# Altium project Geiger counter schema.PrjPcb
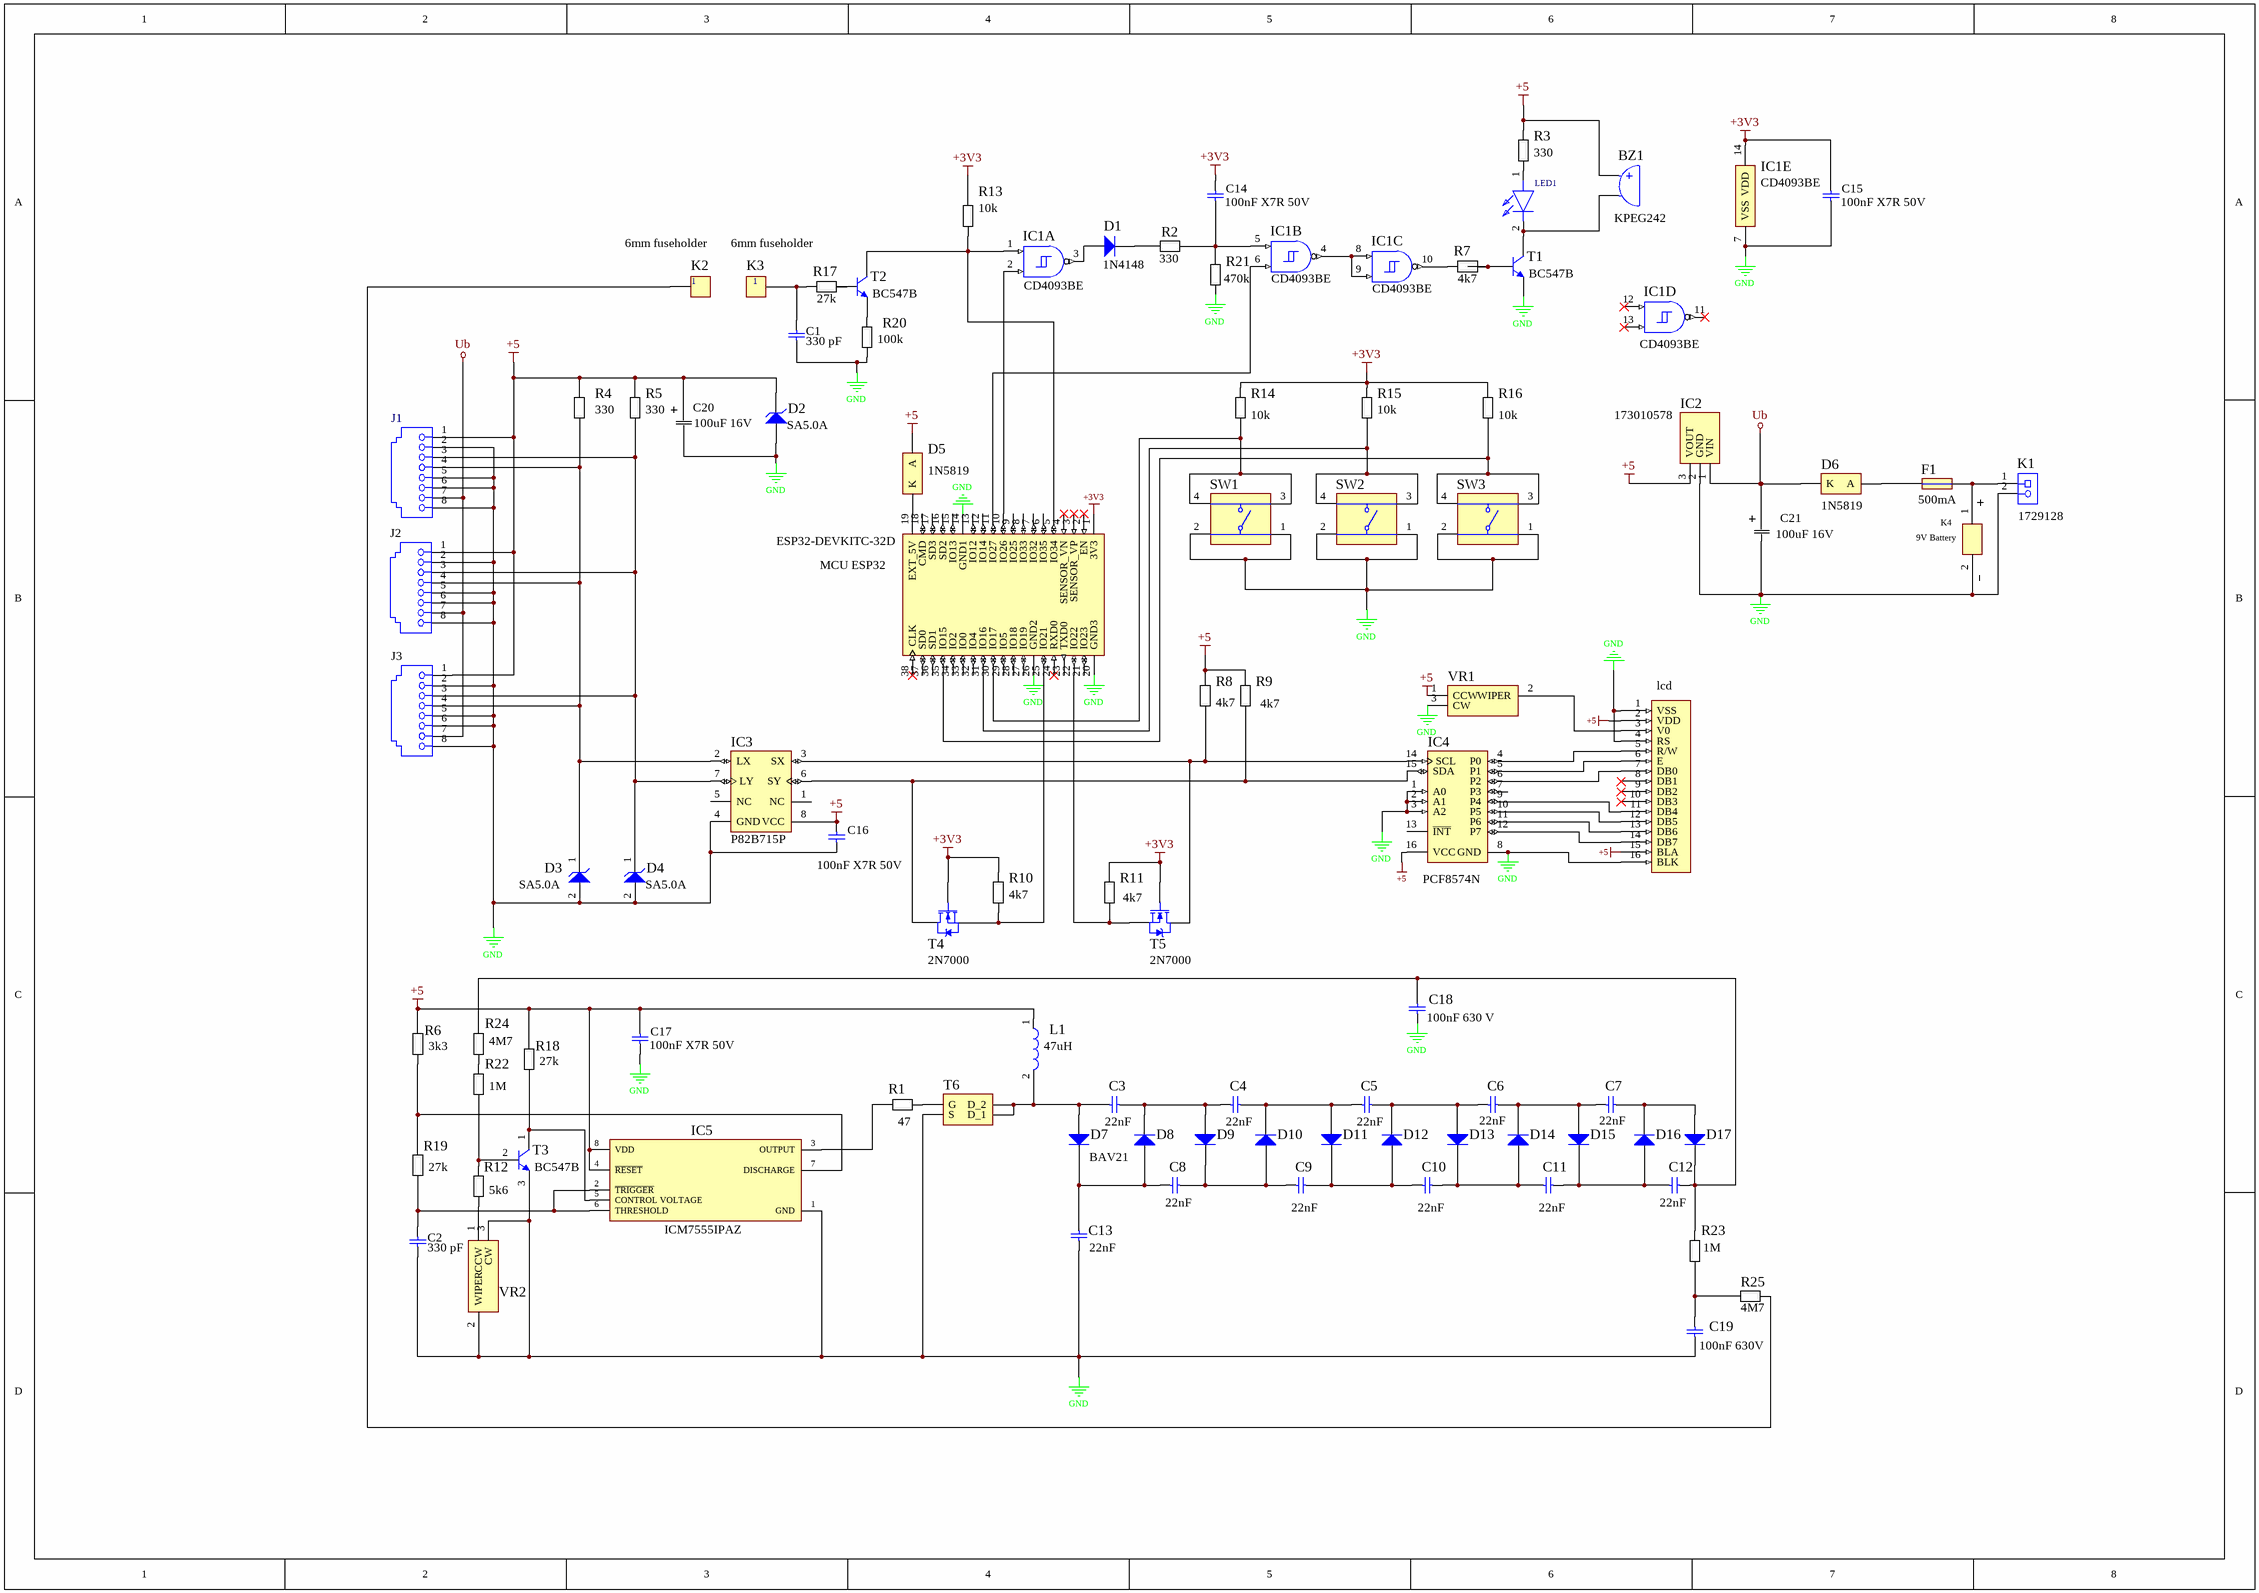
[diagram p0: Sheet1.SchDoc]
1 sheet, 92 parts. Net scope: global (net labels, ports and power ports of the same name join across sheets).
Board file: PCB1.PcbDoc

## Sheet Sheet1.SchDoc
size A2; SheetNumber: 1; SheetTotal: 1

### Parts
BZ1  KPEG242  [KINGS-KPEG242-2]
C1  330 pF  [CAPC2013X70X45NL10T25]
C2  330 pF  [CAPC2013X70X45NL10T25]
C3  22nF  [VISH-BFC233820104-2_V]
C4  22nF  [VISH-BFC233820104-2_V]
C5  22nF  [VISH-BFC233820104-2_V]
C6  22nF  [VISH-BFC233820104-2_V]
C7  22nF  [VISH-BFC233820104-2_V]
C8  22nF  [VISH-BFC233820104-2_V]
C9  22nF  [VISH-BFC233820104-2_V]
C10  22nF  [VISH-BFC233820104-2_V]
C11  22nF  [VISH-BFC233820104-2_V]
C12  22nF  [VISH-BFC233820104-2_V]
C13  22nF  [VISH-BFC233820104-2_V]
C14  100nF X7R 50V  [CAPC2013X70X45NL10T25]
C15  100nF X7R 50V  [CAPC2013X70X45NL10T25]
C16  100nF X7R 50V  [CAPC2013X70X45NL10T25]
C17  100nF X7R 50V  [CAPC2013X70X45NL10T25]
C18  100nF 630 V  [CAPC1812(4532)125_M]
C19  100nF 630V  [CAPC1812(4532)125_M]
C20  100uF 16V  [100uf 16V elco]
C21  100uF 16V  [100uf 16V elco]
D1  1N4148  [NXP-SOD27-2_V]
D2  SA5.0A  [ONSC-AXIAL_LEAD-2-59AA-01_P]
D3  SA5.0A  [ONSC-AXIAL_LEAD-2-59AA-01_P]
D4  SA5.0A  [ONSC-AXIAL_LEAD-2-59AA-01_P]
D5  1N5819  [ONSC-AXIAL_LEAD-2-59-10_P]
D6  1N5819  [ONSC-AXIAL_LEAD-2-59-10_P]
D7  BAV21  [MCSM-DO-35-2]
D8  BAV21  [MCSM-DO-35-2]  (value not drawn)
D9  BAV21  [MCSM-DO-35-2]  (value not drawn)
D10  BAV21  [MCSM-DO-35-2]  (value not drawn)
D11  BAV21  [MCSM-DO-35-2]  (value not drawn)
D12  BAV21  [MCSM-DO-35-2]  (value not drawn)
D13  BAV21  [MCSM-DO-35-2]  (value not drawn)
D14  BAV21  [MCSM-DO-35-2]  (value not drawn)
D15  BAV21  [MCSM-DO-35-2]  (value not drawn)
D16  BAV21  [MCSM-DO-35-2]  (value not drawn)
D17  BAV21  [MCSM-DO-35-2]  (value not drawn)
F1  500mA  [39211000000]
IC1  CD4093BE  [N0014A]  (parts A,B,C,D,E of 5)
IC2  173010578  [173010578]
IC3  P82B715P  [P0008A]
IC4  PCF8574N  [N0016A]
IC5  ICM7555IPAZ  [Intersil_ICM7555IPAZ_0]
J1  615008138021  [615008138021]  (value not drawn)
J2  615008138021  [615008138021]  (value not drawn)
J3  615008138021  [615008138021]  (value not drawn)
K1  1729128  [PHOE-1729128-2_V]
K2  6mm fuseholder  [FP-102-MFG]
K3  6mm fuseholder  [FP-102-MFG]
K4  9V Battery  [PCBComponent_1]
L1  47uH  [WE-TI-LS]
lcd  (no value)  [PCBComponent_1]
LED1  151033GS03000  [151033GS03000]  (value not drawn)
MCU_ESP32  ESP32-DEVKITC-32D  [MODULE_ESP32-DEVKITC-32D]
R1  47  [FP-RC1206-IPC_C]
R2  330  [FP-RC1206-IPC_C]
R3  330  [FP-RC1206-IPC_C]
R4  330  [FP-RC1206-IPC_C]
R5  330  [FP-RC1206-IPC_C]
R6  3k3  [FP-RC1206-IPC_C]
R7  4k7  [FP-RC1206-IPC_C]
R8  4k7  [FP-RC1206-IPC_C]
R9  4k7  [FP-RC1206-IPC_C]
R10  4k7  [FP-RC1206-IPC_C]
R11  4k7  [FP-RC1206-IPC_C]
R12  5k6  [FP-RC1206-IPC_C]
R13  10k  [FP-RC1206-IPC_C]
R14  10k  [FP-RC1206-IPC_C]
R15  10k  [FP-RC1206-IPC_C]
R16  10k  [FP-RC1206-IPC_C]
R17  27k  [FP-RC1206-IPC_C]
R18  27k  [FP-RC1206-IPC_C]
R19  27k  [FP-RC1206-IPC_C]
R20  100k  [FP-RC1206-IPC_C]
R21  470k  [FP-RC1206-IPC_C]
R22  1M  [RES_VR25]
R23  1M  [RES_VR25]
R24  4M7  [RES_VR25]
R25  4M7  [RES_VR25]
SW1  tactile switch 10mm  [TECO-1825910-6_V]  (value not drawn)
SW2  tactile switch 10mm  [TECO-1825910-6_V]  (value not drawn)
SW3  tactile switch 10mm  [TECO-1825910-6_V]  (value not drawn)
T1  BC547B  [ONSC-TO-92-3-29-11]
T2  BC547B  [ONSC-TO-92-3-29-11]
T3  BC547B  [ONSC-TO-92-3-29-11]
T4  2N7000  [ONSC-TO-92-3-29-11]
T5  2N7000  [ONSC-TO-92-3-29-11]
T6  (no value)  [DIP920W60P254L490H337Q4N]
VR1  (no value)  [RM065102]
VR2  (no value)  [RM065102]

### Nets
+3V3: C14.2 C15.2 IC1.14(VDD) MCU_ESP32.1(3V3) R10.2 R11.2 R13.1 R14.2 R15.2 R16.2 T4.2(G) T5.2(G)
+5: BZ1.1 C16.2 C17.2 C20.2 D2.1(K) D5.2(A) IC2.3(VOUT) IC3.8(VCC) IC4.16(VCC) IC5.4(~{RESET}) IC5.8(VDD) J1.1 J2.1 J3.1 L1.1 lcd.2(VDD) lcd.15(BLA) R3.1 R4.2 R5.2 R6.2 R8.2 R9.2 R18.2 VR1.1(CCW)
GND: C1.1 C2.1 C13.1 C15.1 C16.1 C17.1 C18.1 C19.1 C20.1 C21.1 D2.2(A) D3.2(A) D4.2(A) IC1.7(VSS) IC2.2(GND) IC3.4(GND) IC4.1(A0) IC4.2(A1) IC4.3(A2) IC4.8(GND) IC5.1(GND) J1.2 J1.5 J1.6 J1.8 J2.2 J2.5 J2.6 J2.8 J3.2 J3.5 J3.6 J3.8 K1.2 K4.2 lcd.1(VSS) lcd.4(RS) lcd.16(BLK) MCU_ESP32.14(GND1) MCU_ESP32.20(GND3) MCU_ESP32.26(GND2) R20.2 R21.1 SW1.1 SW1.2 SW2.1 SW2.2 SW3.1 SW3.2 T1.3(E) T3.3(E) T6.2(S) VR1.3(CW) VR2.2(WIPER) VR2.3(CW)
Ub: C21.2 D6.1(K) IC2.1(VIN) J1.7 J2.7 J3.7
NetBZ1_2: BZ1.2 LED1.2(K) T1.1(C)
NetC1_2: C1.2 K3.1 R17.2
NetC2_2: C2.2 IC5.2(~{TRIGGER}) IC5.6(THRESHOLD) R19.1
NetC3_1: C3.1 D7.1(A) L1.2 T6.3(D_1) T6.4(D_2)
NetC3_2: C3.2 C4.1 D8.2(K) D9.1(A)
NetC4_2: C4.2 C5.1 D10.2(K) D11.1(A)
NetC5_2: C5.2 C6.1 D12.2(K) D13.1(A)
NetC6_2: C6.2 C7.1 D14.2(K) D15.1(A)
NetC7_2: C7.2 D16.2(K) D17.1(A)
NetC8_1: C8.1 C13.2 D7.2(K) D8.1(A)
NetC8_2: C8.2 C9.1 D9.2(K) D10.1(A)
NetC9_2: C9.2 C10.1 D11.2(K) D12.1(A)
NetC10_2: C10.2 C11.1 D13.2(K) D14.1(A)
NetC11_2: C11.2 C12.1 D15.2(K) D16.1(A)
NetC12_2: C12.2 C18.2 D17.2(K) R23.2 R24.2
NetC14_1: C14.1 IC1.5(C) R2.2 R21.2
NetC19_2: C19.2 R23.1 R25.1
NetD1_1: D1.1(A) IC1.3(J)
NetD1_2: D1.2(K) R2.1
NetD3_1: D3.1(K) IC3.2(LX) J1.4 J2.4 J3.4 R4.1
NetD4_1: D4.1(K) IC3.7(LY) J1.3 J2.3 J3.3 R5.1
NetD5_1: D5.1(K) MCU_ESP32.19(EXT_5V)
NetD6_2: D6.2(A) F1.1
NetF1_2: F1.2 K1.1 K4.1
NetIC1_1: IC1.1(A) MCU_ESP32.5(IO34) R13.2 T2.1(C)
NetIC1_2: IC1.2(B) MCU_ESP32.10(IO26)
NetIC1_4: IC1.4(K) IC1.8(E) IC1.9(F)
NetIC1_6: IC1.6(D) MCU_ESP32.11(IO27)
NetIC1_10: IC1.10(L) R7.2
NetIC3_3: IC3.3(SX) IC4.14(SCL) R8.1 T5.3(D)
NetIC3_6: IC3.6(SY) IC4.15(SDA) R9.1 T4.3(D)
NetIC4_4: IC4.4(P0) lcd.5(R/W)
NetIC4_5: IC4.5(P1) lcd.6(E)
NetIC4_6: IC4.6(P2) lcd.7(DB0)
NetIC4_9: IC4.9(P4) lcd.11(DB4)
NetIC4_10: IC4.10(P5) lcd.12(DB5)
NetIC4_11: IC4.11(P6) lcd.13(DB6)
NetIC4_12: IC4.12(P7) lcd.14(DB7)
NetIC5_3: IC5.3(OUTPUT) R1.2
NetIC5_5: IC5.5(CONTROL_VOLTAGE) R18.1 T3.1(C)
NetIC5_7: IC5.7(DISCHARGE) R6.1 R19.2
NetK2_1: K2.1 R25.2
Netlcd_3: lcd.3(V0) VR1.2(WIPER)
NetLED1_1: LED1.1(A) R3.2
NetMCU_ESP32_22: MCU_ESP32.22(IO22) R11.1 T5.1(S)
NetMCU_ESP32_25: MCU_ESP32.25(IO21) R10.1 T4.1(S)
NetMCU_ESP32_30: MCU_ESP32.30(IO17) R14.1 SW1.3 SW1.4
NetMCU_ESP32_31: MCU_ESP32.31(IO16) R15.1 SW2.3 SW2.4
NetMCU_ESP32_35: MCU_ESP32.35(IO15) R16.1 SW3.3 SW3.4
NetR1_1: R1.1 T6.1(G)
NetR7_1: R7.1 T1.2(B)
NetR12_1: R12.1 VR2.1(CCW)
NetR12_2: R12.2 R22.1 T3.2(B)
NetR17_1: R17.1 T2.2(B)
NetR20_1: R20.1 T2.3(E)
NetR22_2: R22.2 R24.1

Not connected (* = marked no-connect by the designer): IC1 11(M)* 12(G)* 13(H)*; IC3 1(NC) 5(NC); IC4 7(P3) 13(~{INT}); lcd 8(DB1)* 9(DB2)* 10(DB3)*; MCU_ESP32 2(EN)* 3(SENSOR_VP)* 4(SENSOR_VN)* 6(IO35) 7(IO32) 8(IO33) 9(IO25) 12(IO14) 13(IO12) 15(IO13) 16(SD2) 17(SD3) 18(CMD) 21(IO23) 23(TXD0) 24(RXD0)* 27(IO19) 28(IO18) 29(IO5) 32(IO4) 33(IO0) 34(IO2) 36(SD1) 37(SD0) 38(CLK)*

### Library data of the parts
BZ1 = CMP-2000-06518-1: Piezo Indicator, 4100 Hz, 3 to 16 V, -20 to 70 degC, 2-Pin THD, RoHS; PartNumber: KPE-242; Manufacturer: KingstateElectronicsCorp.; Frequency Range: 3600to4600Hz; Maximum Supply Current: 7mA; Typical Operating Supply Voltage: 12Vdc; Product Height: 7.6mm; Current - Max: 7A; Tone Mode: Continuous; Product Diameter: 13.7mm; Minimum Sound Pressure: 70dBA; Maximum Resonant Frequency: 4600Hz; Type: Indicator; Datasheet URL: https://datasheet.ciiva.com/11776/0900766b8068f3a2-11776713.pdf; Mounting: ThroughHole; Technology: Piezo; Operating Temperature: -20to70°C; Category: AudioIndicatorsandAlerts; Termination Method: Pin; Manufacturer URL: http://www.kingstate.com.tw/index.php/en/; Package Description: 2-Pin Through Hole Device, Body Dia 13.7 mm, Pitch 7.62 mm; Datasheet Version: 01/2006; Package Reference: KPEG242; Mounting Technology: ThroughHole
C1 C2 C14-C17 = CMP-2007-00889-1: Manufacturer: Murata; Part Number: GRM2165C1H332JA01D
C3-C13 = CMP-0478-00361-1: Condensator X2 Condensator 275VAC X2 Polypropyleen Film Condensator 0.022Uf 22nF Pitch 10Mm12.5 x 6 x 12 mm THD, RoHS, Bulk; PartNumber: BFC233820104; Manufacturer: Vishay Semiconductor; Capacitance Tolerance: +/- 20%; Permisssible DC Voltage: 630 V; Rated AC Voltage: 310 V; Capacitance: 0.1 uF; Rated Voltage Pulse Slope: 600 V/us; Mounting Technology: Through Hole; DatasheetVersion: Jul-13; Packing: Bulk; ComponentLink1Description: Manufacturer URL; RoHS: TRUE; ComponentLink3Description: Package Specification; PackageReference: BFC233820104-2; ComponentLink2Description: Datasheet; ComponentLink3URL: http://www.vishay.com/docs/28119/mkp3382.pdf; PackageVersion: Jul-13; ComponentLink1URL: http://www.vishay.com/; PackageDescription: 2-Pin THD, Body 12.5 x 6 mm, Height 12 mm, Pitch 10mm; ComponentLink2URL: http://www.vishay.com/docs/28119/mkp3382.pdf
C18 C19 = CMP-1040-01539-1: CAP 470nF 50V ±10% 1812 (4532 Metric) Thickness 1.25mm SMD; Tolerance: Â±10%; Case-Metric: 4532; Case-EIA: 1812; Technology: SMT; Max Thickness: 1.25 mm; Value: 470nF; Rated Voltage: 50 V
C20 C21 K4 lcd = Component_1
D1 = CMP-0648-00002-1: High-speed Diode, 100 V, 450 mA, 2-Pin SOD27, RoHS; Manufacturer: NXP Semiconductors; Configuration: Single; IR (VR: 20 V)=25 nA; IFRM: 450 mA; IFSM: 4 A Max.; Trr: 4 ns Max.; Cd: 4 pF Max.; VR: 100 V Max.; VF (IF: 10 mA)=1 V; IF: 200 mA Max.; ComponentLink1Description: Manufacturer URL; RoHS: TRUE; ComponentLink1URL: http://www.nxp.com/; ComponentLink3Description: Package Specification; DatasheetVersion: Aug-04; ComponentLink2Description: Datasheet; PackageVersion: Aug-04; PackageReference: SOD27; ComponentLink3URL: http://www.nxp.com/documents/data_sheet/1N4148_1N4448.pdf; Mounting Technology: Through Hole; ComponentLink2URL: http://www.nxp.com/documents/data_sheet/1N4148_1N4448.pdf; PartNumber: 1N4148; PackageDescription: 2-Pin Hermetically Sealed Glass Package, Axial Leaded, Dia 1.85 mm, Body Length 4.25 mm, Lead Spread 25.4 mm
D2-D4 = CMP-1061-00012-1: 500 W Peak Power, MiniMOSORB(TM) Zener Transient Voltage Suppressor, Unidirectional, 2-Pin Axial_Lead, Bulk Box; Manufacturer: On Semiconductor; V(BR) Typ (V): 6.7; IR Max (uA): 600; PPK Max (W): 500; Mounting Technology: Through Hole; ComponentLink3URL: http://www.onsemi.com/pub_link/Collateral/59AA.PDF; ComponentLink2URL: http://www.onsemi.com/pub_link/Collateral/SA5.0A-D.PDF; Direction: Unidirectional; PackageDescription: 2-Pin, Axial Lead, Diameter 3.1 mm; PackageReference: AXIAL_LEAD-2-59AA-01; PartNumber: SA5.0A; ComponentLink1URL: http://www.onsemi.com/; Packing: Bulk Box; ComponentLink3Description: Package Specification; ComponentLink2Description: Datasheet; PackageVersion: Rev. A, 02/2007; DatasheetVersion: Rev. 13; ComponentLink1Description: Manufacturer URL
D5 D6 = CMP-1055-00042-1: Rectifier, 2-Pin Axial_Lead, Pb-Free, Bulk Bag; Manufacturer: On Semiconductor; IFSM Max (A): 25; Configuration: Single; Note1: 0; PackageDescription: 2-Pin, Axial Lead, Diameter 2.35 mm; Mounting Technology: Through Hole; Packing: Bulk Bag; RoHS: TRUE; DatasheetVersion: Rev. 10; ComponentLink3Description: Package Specification; ComponentLink1URL: http://www.onsemi.com/; ComponentLink2Description: Datasheet; PackageReference: AXIAL_LEAD-2-59-10; ComponentLink3URL: http://www.onsemi.cn/pub_link/Collateral/59-10.PDF; PackageVersion: Rev. U, 02/2005; PartNumber: 1N5819; ComponentLink1Description: Manufacturer URL; ComponentLink2URL: http://www.onsemi.cn/pub_link/Collateral/1N5817-D.PDF
D7-D17 = CMP-2000-06494-1: BAV21TR Diode 250V 0.2A DO35; PartNumber: 1N4148-1; Manufacturer: Microsemi; Type: SwitchingDiode; Peak Reverse Recovery Time: 5ns; Rad Hard: No; Configuration: Single; Peak Forward Voltage: 1.2@0.1AV; Peak Reverse Repetitive Voltage: 75V; Breakdown Voltage: 100V; Peak Reverse Current: 0.5uA; Operating Temperature: -65to200°C; Package Description: 2-Pin Axial Lead, Dia 1.665 mm, Body Length 4.065 mm; Package: 2DO-35; Peak Average Forward Current: 0.2A; Output Current: 0.2A; Mounting: ThroughHole; Mounting Technology: ThroughHole; Packaging: Bulk; Datasheet Version: Rev. 1, 11/2012; Manufacturer URL: http://www.microsemi.com/; Package Reference: DO-35-2; Datasheet URL: http://www.microsemi.com/document-portal/doc_download/125211-lds-0281
F1 = 39211000000: Fuse; Manufacturer_Name: LITTELFUSE; Datasheet Link: https://datasheet.lcsc.com/szlcsc/Littelfuse-39211000000_C99566.pdf; Height: 8mm; Manufacturer_Part_Number: 39211000000; Mouser Part Number: 576-3921100000; Mouser Price/Stock: https://www.mouser.co.uk/ProductDetail/Littelfuse/39211000000?qs=x71drwq5GondAmkqFlpf6Q%3D%3D; Arrow Part Number: 39211000000; Arrow Price/Stock: https://www.arrow.com/en/products/39211000000/littelfuse
IC1 = CMP-1627-00493-3: CMOS Quad 2-Input NAND Schmitt Triggers, N0014A, TUBE; Manufacturer: Texas Instruments; ICC @ Nom Voltage(Max)(mA): 0.06; VCC(Min)(V): 3; Rating: Catalog; Bits(#): 4; Technology Family: CD4000; Output Drive (IOL/IOH)(Max)(mA): 1.5/-1.5; VCC(Max)(V): 18; Voltage(Nom)(V): 10; Schmitt Trigger: Yes; F @ Nom Voltage(Max)(Mhz): 8; DatasheetVersion: SCHS115D; PackageReference: N0014A; Code_JEDEC: MS-001; Output Type: CMOS; Input Type: CMOS; Generic Part Number: CD4093B; Operating Temperature Range(C): -55 to 125
IC2 = 173010578: Undefined or Miscellaneous; Manufacturer_Name: Wurth Elektronik; Datasheet Link: https://componentsearchengine.com//173010578.pdf; Height: 8.5mm; Mouser2 Part Number: 710-173010578; Mouser2 Price/Stock: https://www.mouser.com/Search/Refine.aspx?Keyword=710-173010578; Manufacturer_Part_Number: 173010578
IC3 = CMP-0314-00015-2: I2C Bus Extender, 2 Channel Width, 3.0 to 12.0 V, -40 to 85 degC, 8-pin PDIP (P), Pb-Free (RoHS); Manufacturer: Texas Instruments; Master Side I2C Bus Capacitance Supported(pF): 400; VCC(Min)(V): 3; Open Drain I/O Type: Yes; Eco-Plan: Green (RoHS & no Sb/Br); Channel Width: 2; SubFamily: I2C Hub, Buffer, Repeater; VCC(Max)(V): 12; ComponentLink2URL: http://www.ti.com/litv/pdf/mpdi001b; Code_JEDEC: MS-001-BA; Vcc range(V): 3.0 to 12.0; PackageReference: P0008A; ComponentLink2Description: Package Specification; PackageVersion: revE, Apr-2010; Slave Side I2C Bus Capacitance Supported(pF): 400; ComponentLink1Description: Datasheet; Max Frequency(kHz): 400; ComponentLink1URL: http://www.ti.com/general/docs/lit/getliterature.tsp?genericPartNumber=P82B715&fileType=pdf; DatasheetVersion: SCPS145A; PartNumber: P82B715P; PackageDescription: 8-Pin Plastic Dual-In-Line Package, Row Spacing 7.62 mm, Pitch 2.54 mm; 5V Tolerant I/O: Yes; Mounting Technology: Through-hole
IC4 = CMP-0314-00016-2: Remote 8-Bit I/O Expander for I2C-Bus, 2.5 to 6 V, -40 to 85 degC, 16-pin PDIP (N), Pb-Free (RoHS); Manufacturer: Texas Instruments; fSCLK(Max)(MHz): 0.1; # of I/Os: 8; VCC(Min)(V): 2.5; I2C Address: 0100 xxx; Voltage Nodes(V): 5, 3.3; Eco-Plan: Green (RoHS & no Sb/Br); Max Frequency(kHz): 100; SubFamily: I2C IO Expander; VCC(Max)(V): 6; Interrupt Output: Yes; Vcc range(V): 2.5 to 6.0; Reset Input: No; ComponentLink1Description: Datasheet; ComponentLink1URL: http://www.ti.com/general/docs/lit/getliterature.tsp?genericPartNumber=PCF8574&fileType=pdf; PackageDescription: 16-Pin Plastic Dual-In-Line Package, Row Spacing 7.62 mm, Pitch 2.54 mm; PackageVersion: revE, Dec-2002; ComponentLink2URL: http://www.ti.com/litv/pdf/mpdi002c; ComponentLink2Description: Package Specification; DatasheetVersion: SCPS068G; PackageReference: N0016A; PartNumber: PCF8574N; Push-Pull I/O Type: Yes; Code_JEDEC: MS-001*; Mounting Technology: Through-hole
J1-J3 = CMP-1502-01725-1: Modular Jack WR-MJ, Plastic, Vertical Entry, THT, 8P8C; Manufacturer: Wurth Elektronik; Withstanding Voltage: 1000VAC; Contact Resistance: 20mOhm; Port: 1x1; Working Voltage: 120VAC; Rated Current: 1.5A; Compliance: Leadfree/RoHS; Entrance: Vertical; Publisher: WurthElektronik; Datasheet URL: https://katalog.we-online.de/em/datasheet/615008138021.pdf; Part Number: 615008138021; Manufacturer URL: http://www.we-online.de; Pin Number: 8P8C; Mounting Technology: THT; Operating Temperature: -40to85degC; Package Reference: 615008138021; Packaging: Tray
K1 = CMP-2000-05815-1: PCB Terminal Block, 13.5 A, 400 V, 2-Pin THD, RoHS, Bulk; Manufacturer: Phoenix Contact; Package Version: 03/2015; No. of Rows: 1; Pitch: 5.08mm; No. of Positions: 2; Voltage Rating: 400V; Current Rating: 13500mA; Manufacturer URL: http://www.phoenixcontact.com/; Datasheet URL: https://datasheet.ciiva.com/16046/1729128-16046181.pdf; RoHS: TRUE; Package URL: https://www.phoenixcontact.com/online/portal/pi/pxc/product_detail_page/!ut/p/b1/3VdJjqNKFDxLH8AFycySyWY2ozFsEPOMMQaDOX1XedGL_1Vdm5YXJleknhSKeBkvI6EA8ncAo3AYoDhBQGco6KN7VURTdemj9us_IEKEZo_YHiPAEWEFmDGOHMORkqKYCORBZxgL7ZoaZYcbFFUZ3fqxSY6GOuxydWUuHqz1ynmMFygu583Bob0Ewr6Sd_l-5m-kAueHiB0jpRwZwe58wwtkpxtMYd_LmGcDRU02dRNEyWt6Y2ti5pSyJ_reIkzIulrqApdnbT11V5jnCKbYNCvhEM1MCpPByat_X379-iThf08CI5GfOPqfBeS3BRoBOdD55AKVv0iLwCMq-2BrzXWSGRH7pUGD9uwXQjiph3xL0DKQwdGa0JImiIOmBNOestqgwTHSSs2oOep-78apyXQBvNi8ZLaFjvjWvcaUEBu0MC6Wbe-d6mB0FAebo2lUWinqYaZs5DAYzV0RP9yitUjnGJ0iI9xhZkT42OCQNUJJhkgWINNQLP2JFP6OpMg3JCVg70jqHT0lvKOnhHf0lPuOnnLf0VPuWx6_dxwUIvwk5WMkT0kLL1mh61l2yZVSzG3pYV_bqo-mj6uMKwKwdnnW8Jh5RTOJzMOA5c-eJDaZQw4mTMPH02PvS_ZAqNVjVTo2WyYLkwH_KU1mmmG5kjRhDqPXLwwVHvVOjCM60-fpXvTDfMGW1PVFVS1r4e4yVDk4ZdNbkUHvqPqQSeian4UD39fNKmachqdJ1NJbyk8rXT9mXTvPk3oE5meulKGgiruPJek-4I9hTT6G8ZLOyRSm2RRVbThERQad5OS28hdt4YW4vG0stgYYzsWsK4_7y6DZMjJSCqri1kyiZR5vD7pwIrNR7QwPHTcLTI5qT7eRlpHrdGiupYlqQDJ7zy_CND8fWWBoLRXxk1RVcXiBQwbTD4Xi7KL-FuO94t9xaqweXzH; PartNumber: 1729128; Package Description: 2-Pin Through Hole Device, Body 8.1 x 10.16 mm, Pitch 5.08 mm; Datasheet Version: 12/2013; Mounting Technology: ThroughHole; Orientation: Horizontal; Package Reference: 1729128-2; Packing: Bulk
K2 K3 = CMP-08604-000017-1: FUSE CLIP CARTRIDGE 250V 15A PCB; Manufacturer: Littelfuse Inc; Manufacturer Part Number: 01020071Z; Is Female: yes; Number Of Fuses: 1; Conn Orientation: Vertical; ComponentLink2Description: Datasheet; Mouser Description: Fuse Clips ACS 3AG PC CLIP; RoHS: TRUE; Package: 102; Category: Fuse; Voltage Rating Dc: 250V; Digikey Description: FUSE CLIP CARTRIDGE 250V 15A PCB; Automotive: No; Device Class L1: Circuit Protection; Octopart: https://octopart.com/01020071z-littelfuse-18837869; Device Class L2: Fuse Holders; Height: 10.67mm; Voltage Rating Ac: 250V; ComponentLink2URL: https://www.littelfuse.com/~/media/electronics/datasheets/fuse_clips/littelfuse_fuse_clip_102_122_datasheet.pdf.pdf; Fuse Current: 15A; Device Class L3: unset; Lead Free: Yes
L1 = CMP-0225-00030-1: Radial Leaded Wire Wound Inductor WE-TI, L = 100 µH; Inductance: 100 ÂµH; ComponentLink2Description: Datasheet; ComponentLink2URL: http://www.we-online.de/katalog/media/pdf/744741101.pdf; PackageReference: WE-TI-LS; ComponentLink1URL: http://www.we-online.com; PackageDescription: THT Inductor, 2-Leads, Body 8.0 x 8.0 mm; ComponentLink1Description: Manufacturer Link; PackageVersion: 2004; DatasheetVersion: ver 2, Nov-2004
LED1 = 151033GS03000: LED; Manufacturer_Name: Wurth Elektronik; Datasheet Link: https://www.mouser.com/datasheet/2/445/151033GS03000-1715304.pdf; Height: 5.55mm; Manufacturer_Part_Number: 151033GS03000; Mouser Part Number: 710-151033GS03000; Mouser Price/Stock: https://www.mouser.com/Search/Refine.aspx?Keyword=710-151033GS03000
MCU_ESP32 = ESP32-DEVKITC-32D: EVAL BOARD FOR ESP-WROOM-32; MF: Espressif Systems; Value: *; MP: ESP32-DEVKITC-32D; Price: None; Check_prices: https://www.snapeda.com/parts/ESP32-DEVKITC-32D/Espressif%20Systems/view-part/2777395/?ref=eda; SnapEDA_Link: https://www.snapeda.com/parts/ESP32-DEVKITC-32D/Espressif%20Systems/view-part/2777395/?ref=snap; Availability: Warning; Purchase-URL: https://pricing.snapeda.com/search/part/ESP32-DEVKITC-32D/?ref=eda; Package: None
R1-R21 = 1206 weerstand
R22-R25 = VR25000001004JA100: No Description Available; Vendor: Vishay; Built_By: EMA_UL_Team; Manufacturer_Part_Number: VR25000001004JA100; Copyright: Copyright (C) 2018 Accelerated Designs. All rights reserved; RefDes: RefDes; Type: DEV
SW1-SW3 = CMP-1684-00021-1: Tact Switch, SPST-NO, 0.05 A, -35 to 85 degC, 4-Pin THD, RoHS, Bulk; Part No: 1825910-6; Manufacturer: TE Connectivity; Maximum Contact Resistance: 100mOhm; Mechanical Life: 100000Cycles; Bushing Type: Unthreaded; Switch Configuration: OFF(ON); Maximum DC Voltage Rating: 24V; Contact Rating @ Voltage: 0.05A@24VDC; Actuator Color: Black; Body Orientation: Straight; Function: MomentaryContact; Illumination: N/R; Actuator Style: RoundButton; Actuator Material: PolybutyleneTerephthalate; Dielectric Strength: 500VAC; Pole Throw Configuration: SPST; Actuator Length: 1.4mm; Product Weight: N/A; Contact Material: CopperAlloy; Housing Material: N/A; Terminal Type: PCPins; Minimum Insulation Resistance: 100MOhm; Package Description: 4-Pin Through Hole Device, Body 5.99 x 5.99 mm, Pitch 6.5 mm; Package Reference: THD; Base Material: N/A; Manufacturer URL: http://www.te.com; Contact Plating: Silver; RoHS: Yes; Datasheet Version: Rev. C9; Electrical Life: 100000Cycles; Maximum AC Voltage Rating: N/A; Thread Size: N/R; Operating Temperature: -35to85C; Mounting: ThroughHole; Dimension: 5.99x5mm; Datasheet URL: http://www.te.com/commerce/DocumentDelivery/DDEController?Action=showdoc&DocId=Customer+Drawing%7F1825910%7FC9%7Fpdf%7FEnglish%7FENG_CD_1825910_C9.pdf%7F1825910-6; Family: 1825910; Seal Location: N/A; Seal Description: N/A; Packaging: N/A
T1-T3 = CMP-1048-01467-1: Amplifier Transistor, NPN Silicon, 3-Pin TO-92, Bulk Box; Manufacturer: On Semiconductor; IC Continuous (A): 0.1; fT Min (MHz): 150; DatasheetVersion: Rev. 7; ComponentLink1URL: http://www.onsemi.com/; Polarity: NPN; RoHS: FALSE; ComponentLink1Description: Manufacturer URL; Packing: Bulk Box; PackageDescription: 3-Pin Transistor Outline, Body 4.825 x 3.685 mm, Pitch 1.27 mm; ComponentLink3URL: http://www.onsemi.cn/pub_link/Collateral/2N6426-D.PDF; ComponentLink2Description: Datasheet; PackageVersion: Rev. AM; PackageReference: TO-92-3-29-11_AM_SL; ComponentLink3Description: Package Specification; Mounting Technology: Through Hole; PartNumber: BC547B; ComponentLink2URL: http://www.onsemi.com/pub_link/Collateral/BC546-D.PDF
T4 T5 = CMP-1058-00936-1: Small Signal MOSFET, 200 mA, 60 V, N-Channel, 3-Pin TO-92, Bulk Box; Manufacturer: On Semiconductor; Ciss Typ (pF): 60; VGS(th) Max (V): 3; Crss Typ (pF): 5; Channel Polarity: N Channel; VGS Max (V): 20; Configuration: Single; PD Max (W): 0.35; Coss Typ (pF): 25; ID Max (A): 0.2; PackageVersion: Rev. AM; ComponentLink3URL: http://www.onsemi.cn/pub_link/Collateral/2N6426-D.PDF; ComponentLink2URL: http://www.onsemi.com/pub_link/Collateral/2N7000-D.PDF; DatasheetVersion: Rev. 8; Mounting Technology: Through Hole; V(BR)DSS Min (V): 60; PartNumber: 2N7000; PackageDescription: 3-Pin Transistor Outline, Body 4.825 x 3.685 mm, Pitch 1.27 mm; ComponentLink2Description: Datasheet; ComponentLink1URL: http://www.onsemi.com/; PackageReference: TO-92-3-29-11_AM_SL; Packing: Bulk Box; ComponentLink1Description: Manufacturer URL; Package Type: TO-92; ComponentLink3Description: Package Specification
T6 = IRLD110PBF: MOSFET (N-Channel); Manufacturer_Name: Vishay; Datasheet Link: http://uk.rs-online.com/web/p/products/0301338P; Height: 3.37mm; Manufacturer_Part_Number: IRLD110PBF; Mouser Part Number: 844-IRLD110PBF; Mouser Price/Stock: https://www.mouser.co.uk/ProductDetail/Vishay-Siliconix/IRLD110PBF/?qs=cvaI6ThkwxutctgzXpBGHg%3D%3D; Arrow Part Number: IRLD110PBF; Arrow Price/Stock: https://www.arrow.com/en/products/irld110pbf/vishay
VR1 VR2 = RM-065-102: Variable Resistor; Manufacturer_Name: Marutsu; Datasheet Link: https://www.marutsu.co.jp/contents/shop/marutsu/datasheet/RM-065.pdf; Height: 7.5mm; Manufacturer_Part_Number: RM-065-102